# EasyEDA Pro project LED_DRIVER.eprj

# Schematic Schematic1
Create Date: 2022-12-01; Page Name: P1; Project Name: LED_DRIVER; Schematic Name: Schematic1; Update Date: 2022-12-01; Company: 东南大学3SE战队; Drawed: 彭延璞
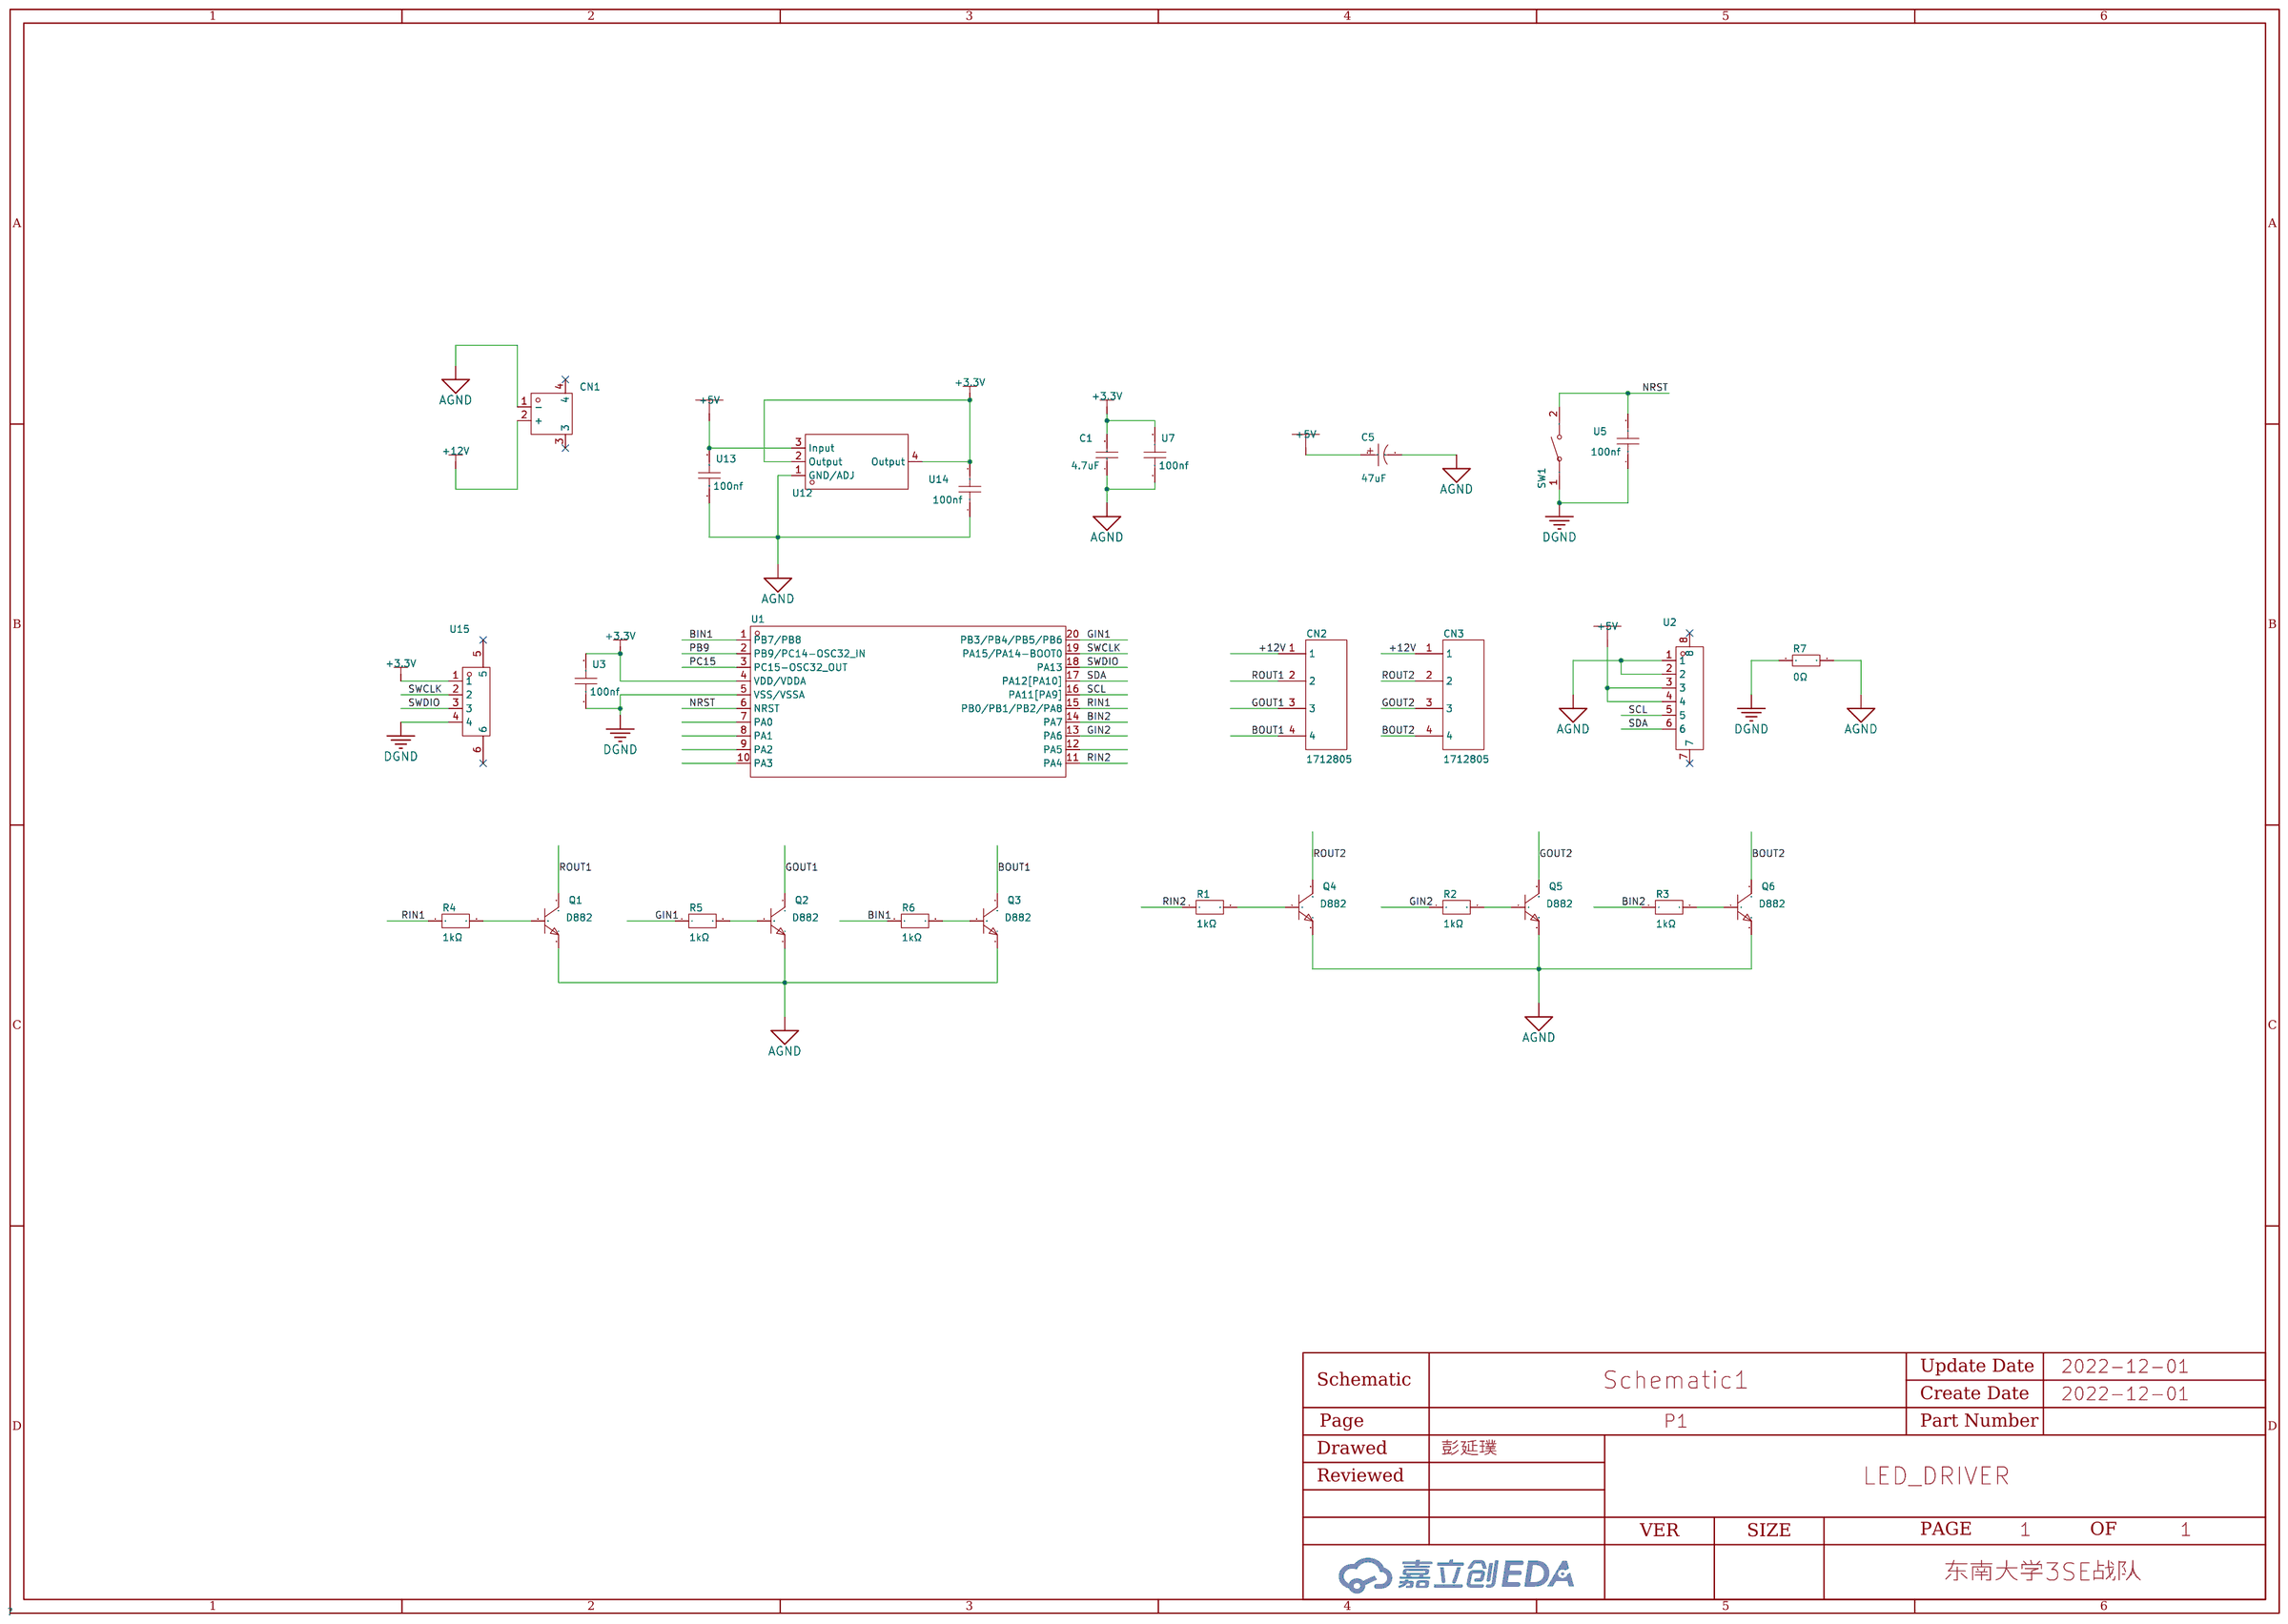
[diagram p0: schematic sheet]

## Parts
C1  4.7uF  [C0603]
C5  47uF  [CAP-SMD_BD6.3-L6.6-W6.6-FD]
CN1  XT60PW-M  [CONN-TH_XT60PW-M]
CN2  1712805  [CONN-TH_4P-P5.08_1712805]
CN3  1712805  [CONN-TH_4P-P5.08_1712805]
Q1  D882  [TO-252-3_L6.5-W5.5-P4.6-LS9.5-BL]
Q2  D882  [TO-252-3_L6.5-W5.5-P4.6-LS9.5-BL]
Q3  D882  [TO-252-3_L6.5-W5.5-P4.6-LS9.5-BL]
Q4  D882  [TO-252-3_L6.5-W5.5-P4.6-LS9.5-BL]
Q5  D882  [TO-252-3_L6.5-W5.5-P4.6-LS9.5-BL]
Q6  D882  [TO-252-3_L6.5-W5.5-P4.6-LS9.5-BL]
R1  1kΩ  [R0603]
R2  1kΩ  [R0603]
R3  1kΩ  [R0603]
R4  1kΩ  [R0603]
R5  1kΩ  [R0603]
R6  1kΩ  [R0603]
R7  0Ω  [R1206]
SW1  -  [KEY-SMD_L6.2-W3.6-LS8.0]
U1  STM32G030F6P6  [TSSOP-20_L6.5-W4.4-P0.65-LS6.4-BL]
U2  -  [CONN-SMD_6P-P1.25_GH1.25-6PWBPZ]
U3  100nf  [C0603]
U5  100nf  [C0603]
U7  100nf  [C0603]
U12  -  [SOT-223-4_L6.5-W3.5-P2.30-LS7.0-BR]
U13  100nf  [C0603]
U14  100nf  [C0603]
U15  -  [CONN-SMD_GH1.25-4PWBPZ]

## Library data of the parts
C1 = 0603F475M160NT: 容值:4.7uF;精度:±20%;额定电压:16V;温度系数:Y5V;; LCSC Part Name: 4.7uF ±20% 16V; Supplier Part: C94039; Manufacturer: FH(风华); Supplier Footprint: 0603; JLCPCB Part Class: Extended Part; Datasheet: https://atta.szlcsc.com/upload/public/pdf/source/20171212/C94039_15130640218931178027.pdf; Supplier: LCSC; Tolerance: ±20%; Voltage Rated: 16V; Temperature Coefficient: Y5V
C5 = RVT1V470M0605_C3344: 容值:47uF;精度:±20%;额定电压:35V;电容体直径:6.3mm;电容体长度:5.4mm;纹波电流:-;等效串联电阻:-;工作寿命:2000hrs@105℃;工作温度:-55℃~+105℃;; LCSC Part Name: 47uF ±20% 35V; Supplier Part: C3344; Manufacturer: HONOR(荣誉); Manufacturer Part: RVT1V470M0605; Supplier Footprint: SMD,6.3x5.4mm; JLCPCB Part Class: Extended Part; Datasheet: https://atta.szlcsc.com/upload/public/pdf/source/20210521/C113284_25C86AE95FB541053FE695F13EA8E7D0.pdf; Supplier: LCSC; Tolerance: ±20%; Rated Voltage: 35V; φD: 6.3mm; L: 5.4mm; Lifetime @ Temp: 2000hrs@105℃; Operating Temperature: -55℃~+105℃
CN1 = XT60PW-M: 模型锂电连接器; LCSC Part Name: XT60PW 公头 板插卧式; Supplier Part: C98732; Manufacturer: AMASS(艾迈斯); Supplier Footprint: Through Hole; JLCPCB Part Class: Extended Part; Datasheet: https://atta.szlcsc.com/upload/public/pdf/source/20180125/C98732_15168617837851301983.pdf; Supplier: LCSC
CN2 CN3 = 1712805: 间距:5.08mm;排数:1;每排PIN数:4;安装方式:直针;额定电流:24A;额定电压:400V;线规 - AWG:-;线规 - mm?:-;工作温度范围:-;颜色:绿色;; LCSC Part Name: 5.08mm 排数:1 每排P数:4 直针 可拼接; Supplier Part: C90087; Manufacturer: Phoenix Contact(菲尼克斯); Supplier Footprint: P=5.08mm; JLCPCB Part Class: 扩展库; Datasheet: https://atta.szlcsc.com/upload/public/pdf/source/20161209/1481271748212.pdf; Supplier: LCSC; Pitch: 5.08mm; Number of Rows: 1; Number of PINs Per Row: 4; Mounting Style: 直针; Current Rating (Max): 24A; Voltage Rating (Max): 400V; Color: 绿色
Q1-Q6 = D882_C2897489: 晶体管类型:NPN;集射极击穿电压(Vceo):30V;集电极电流(Ic):3A;功率(Pd):1.25W;集电极截止电流(Icbo):1uA;集电极-发射极饱和电压(VCE(sat)@Ic,Ib):500mV@2A,200mA;直流电流增益(hFE@Ic,Vce):160@1A,2V;特征频率(fT):80MHz;工作温度:+150@(Tj);; LCSC Part Name: NPN 30V 3A TO-252; Supplier Part: C2897489; Manufacturer: YONGYUTAI(永裕泰); Supplier Footprint: TO-252; JLCPCB Part Class: Extended Part; Datasheet: https://atta.szlcsc.com/upload/public/pdf/source/20210918/5EF979D5544858A19C6B9B735176911E.pdf; Supplier: LCSC; Transistor Type: NPN; Collector-Emitter Breakdown Voltage (Vceo): 30V; Collector Current (Ic): 3A; Power Dissipation (Pd): 1.25W; Collector Cut-Off Current (Icbo): 1uA; Collector-Emitter Saturation Voltage (VCE(sat)@Ic,Ib): 500mV@2A,200mA; DC Current Gain (hFE@Ic,Vce): 160@1A,2V; Transition Frequency (fT): 80MHz; Operating Temperature: +150@(Tj)
R1-R6 = SCR0603J1K: 阻值:1kΩ;精度:±5%;; LCSC Part Name: 1kΩ ±5%; Supplier Part: C3017736; Manufacturer: VO(翔胜); Supplier Footprint: 0603; JLCPCB Part Class: Extended Part; Datasheet: https://atta.szlcsc.com/upload/public/pdf/source/20220513/247AF9639BA21CF93567DC289CCC6A22.pdf; Supplier: LCSC; Tolerance: ±5%
R7 = RK73Z2BTTD: 阻值:0Ω;精度:-;功率:-;工作温度范围:-55~+155;; LCSC Part Name: 0Ω 0; Supplier Part: C131706; Manufacturer: KOA; Supplier Footprint: 1206; JLCPCB Part Class: Extended Part; Datasheet: https://atta.szlcsc.com/upload/public/pdf/source/20170918/C131706_1505727048923976489.pdf; Supplier: LCSC; Operating Temperature Range: -55~+155
SW1 = K2-1107ST-A4DW-06: 触点电流:50mA;额定电压(DC):12V;绝缘电阻:100MΩ;电路结构:单刀单掷;安装方式:立贴;按钮形状:矩形按钮;带灯:-;作用力:250gf@±30gf;机械寿命:100000;工作温度:-25℃~+85℃;开关长度:6.1mm;开关宽度:3.6mm;开关高度:2.5mm;; LCSC Part Name: 轻触开关 3.6*6.1*2.5; Supplier Part: C118141; Manufacturer: 韩国韩荣; Supplier Footprint: SMD; JLCPCB Part Class: Extended Part; Datasheet: https://atta.szlcsc.com/upload/public/pdf/source/20210810/381712CEF248770C072B585C3485C888.pdf; Supplier: LCSC; Contact Current: 50mA; Voltage Rating (DC): 12V; Insulation Resistance: 100MΩ; Circuit: 单刀单掷; Mounting Style: 立贴; Actuator Style: 矩形按钮; Operating Force: 250gf@±30gf; Mechanical Life: 100000; Operating Temperature: -25℃~+85℃; Switch Length: 6.1mm; Switch Width: 3.6mm; Switch Height: 2.5mm
U1 = STM32G030F6P6: CPU位数:-;ROM类型:-;CPU内核:-;主频（MAX):-;工作电压:-;; Supplier Part: C724040; Manufacturer: ST(意法半导体); Supplier Footprint: TSSOP-20; JLCPCB Part Class: Extended Part; Datasheet: https://atta.szlcsc.com/upload/public/pdf/source/20200511/C529329_A1CB615556C746C4EA827FCAD1461480.pdf; Supplier: LCSC
U2 = GH1.25-6PWBPZ: LCSC Part Name: GH1.25-6P卧贴编带; Supplier Part: C2829255; Manufacturer: BOOMELE(博穆精密); JLCPCB Part Class: Extended Part; Datasheet: https://atta.szlcsc.com/upload/public/pdf/source/20211125/08A09A4909F58AF780B71FE423A00F7E.pdf; Supplier: LCSC
U3 U5 U7 U13 U14 = VJ0603Y104KXAAC: Supplier Part: C511432; Manufacturer: VISHAY(威世); Supplier Footprint: 0603; JLCPCB Part Class: Extended Part; Supplier: LCSC
U12 = AMS1117-3.3_C369933: 输出类型:固定;输出极性:正;输出通道数:1;最大输入电压:18V;输出电压:3.3V;压差:1.3V@800mA;静态电流(地电流):8mA;输出电流:1A;电源纹波抑制比(PRSS):-;噪声:-;特性:-;工作温度:-;; LCSC Part Name: Vin=18V Vout=3.3V 1A; Supplier Part: C369933; Manufacturer: KEXIN(科信); Manufacturer Part: AMS1117-3.3; Supplier Footprint: SOT-223; JLCPCB Part Class: Extended Part; Datasheet: https://atta.szlcsc.com/upload/public/pdf/source/20190724/C369933_94137CB0CFA8D6ABD8E5DA714A2C2C4B.pdf; Supplier: LCSC; Output Type: 固定; Output Polarity: 正; Number of Outputs: 1; Maximum Input Voltage: 18V; Output Voltage: 3.3V; Dropout Voltage: 1.3V@800mA; Quiescent Current (Ground Current): 8mA; Output Current: 1A
U15 = GH1.25-4PWBPZ: LCSC Part Name: GH1.25-4P卧贴编带; Supplier Part: C2829253; Manufacturer: BOOMELE(博穆精密); JLCPCB Part Class: Extended Part; Datasheet: https://atta.szlcsc.com/upload/public/pdf/source/20211125/08A09A4909F58AF780B71FE423A00F7E.pdf; Supplier: LCSC

## Nets
+3.3V: C1.2 U1.4(VDD/VDDA) U3.2 U7.2 U12.2(Output) U12.4(Output) U14.2 U15.1
+5V: C5.1 U2.3 U2.4 U12.3(Input) U13.2
+12V: CN1.2(+) CN2.1 CN3.1
AGND: C1.1 C5.2 CN1.1(-) Q1.3(E) Q2.3(E) Q3.3(E) Q4.3(E) Q5.3(E) Q6.3(E) R7.2 U2.1 U2.2 U7.1 U12.1(GND/ADJ) U13.1 U14.1
DGND: R7.1 SW1.1 U1.5(VSS/VSSA) U3.1 U5.1 U15.4
BIN1: R6.1 U1.1(PB7/PB8)
BIN2: R3.1 U1.14(PA7)
BOUT1: CN2.4 Q3.2(C)
BOUT2: CN3.4 Q6.2(C)
GIN1: R5.1 U1.20(PB3/PB4/PB5/PB6)
GIN2: R2.1 U1.13(PA6)
GOUT1: CN2.3 Q2.2(C)
GOUT2: CN3.3 Q5.2(C)
NRST: SW1.2 U1.6(NRST) U5.2
PB9: U1.2(PB9/PC14-OSC32_IN)
PC15: U1.3(PC15-OSC32_OUT)
RIN1: R4.1 U1.15(PB0/PB1/PB2/PA8)
RIN2: R1.1 U1.11(PA4)
ROUT1: CN2.2 Q1.2(C)
ROUT2: CN3.2 Q4.2(C)
SCL: U1.16(PA11[PA9]) U2.5
SDA: U1.17(PA12[PA10]) U2.6
SWCLK: U1.19(PA15/PA14-BOOT0) U15.2
SWDIO: U1.18(PA13) U15.3
$1N1836: Q1.1(B) R4.2
$1N1837: Q2.1(B) R5.2
$1N1838: Q3.1(B) R6.2
$1N1856: Q4.1(B) R1.2
$1N1857: Q5.1(B) R2.2
$1N1858: Q6.1(B) R3.2

Not connected (* = marked no-connect by the designer): CN1 3* 4*; U1 7(PA0) 8(PA1) 9(PA2) 10(PA3) 12(PA5); U2 7* 8*; U15 5* 6*

# Board PCB1
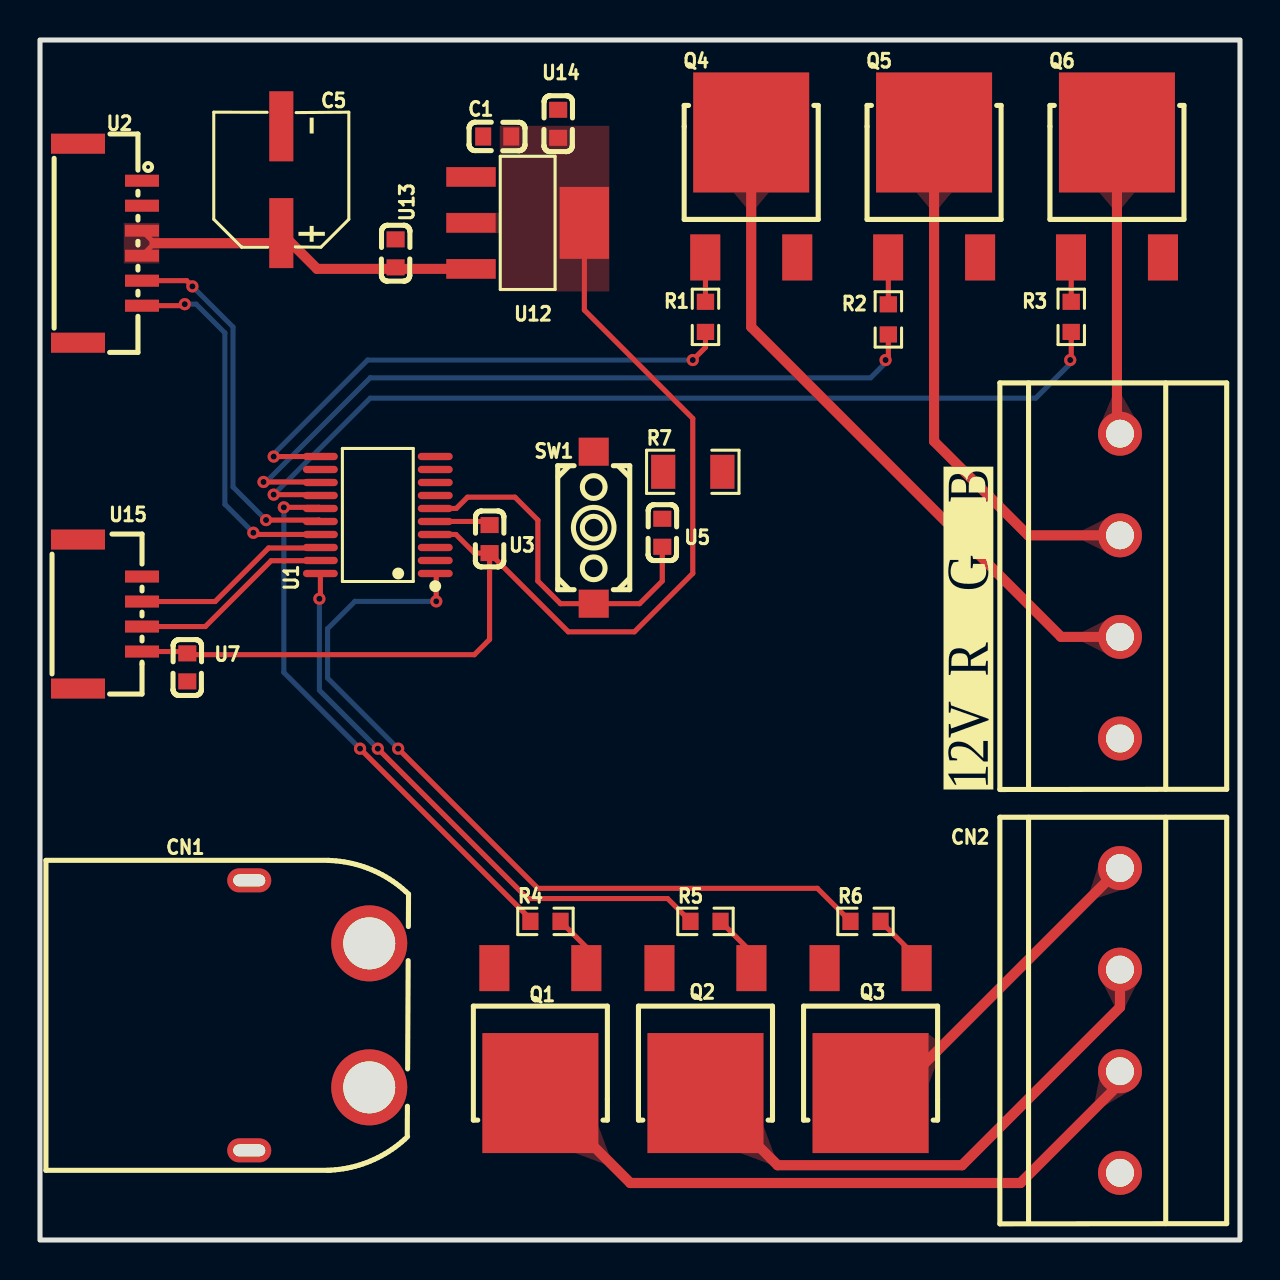
[diagram p1: board, top side]
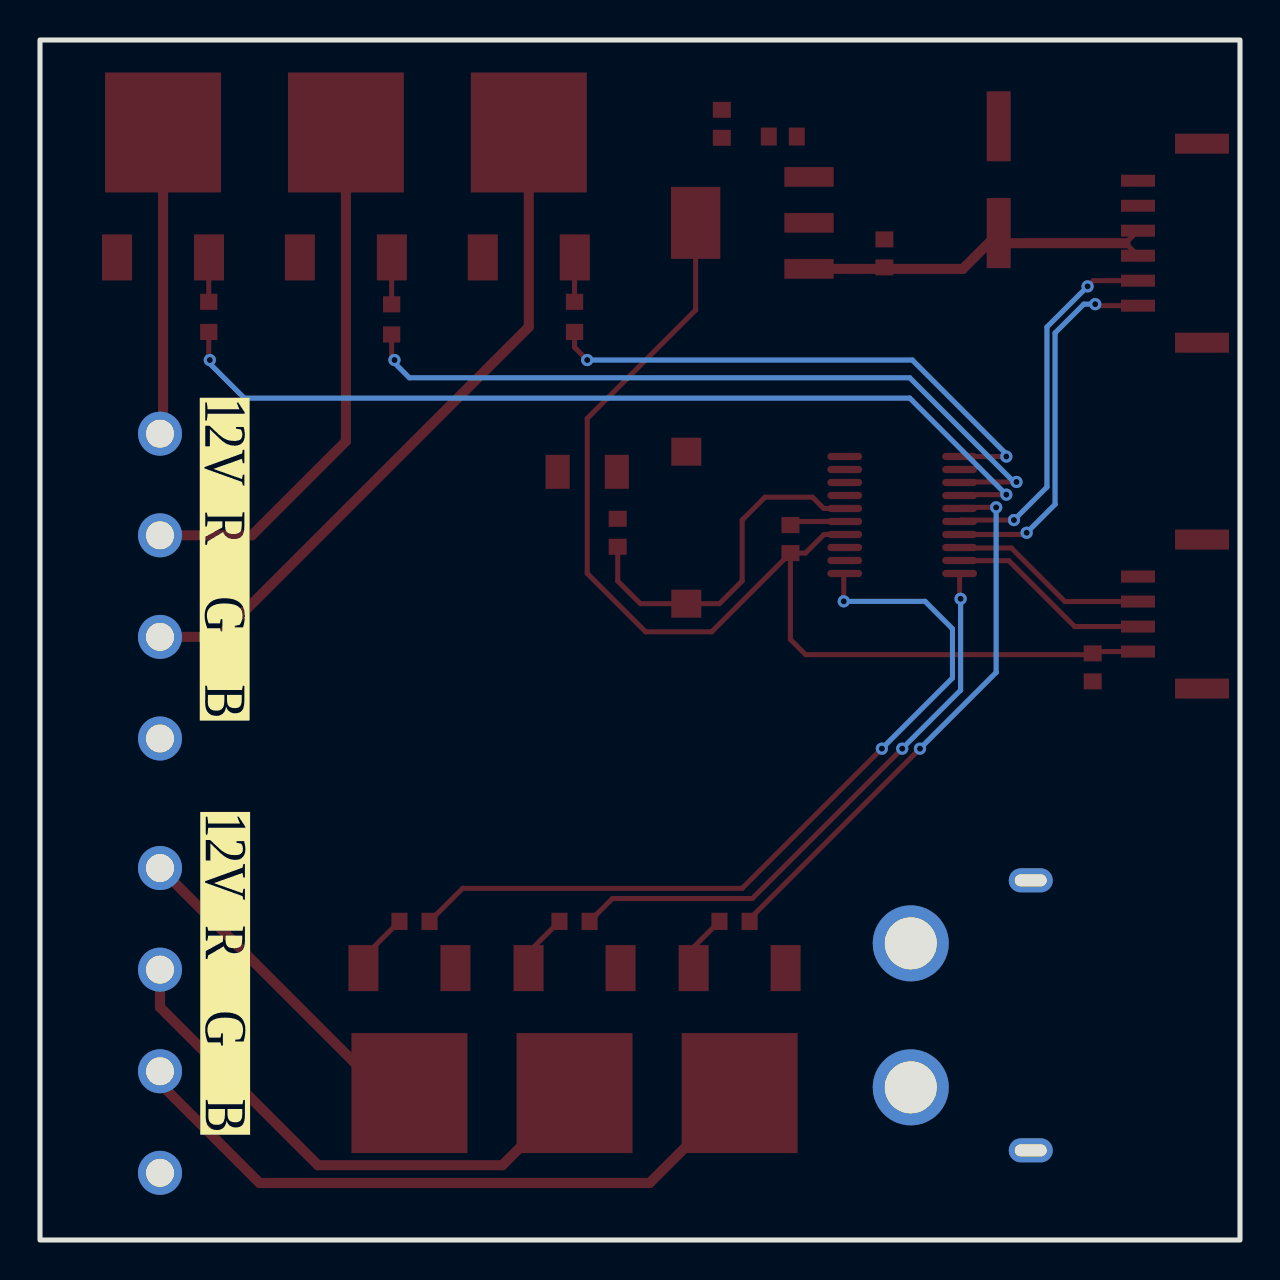
[diagram p2: board, bottom side, seen from below]

Outline 60 x 60 mm; copper layers: Top Layer, Bottom Layer. Coordinates in mm from the lower left corner of the outline.
Outline path: rectangle 0,60 60,0
Stack: Top Layer 0.035mm / Dielectric1 1.51mm FR4 er 4.5 / Bottom Layer 0.035mm

## Design rules (mm)
spacing safeClearance (default): track to track 0.152, other pairs 0.152 to 0.3
track width trackWidth (default): min 0.127, default 0.254, max 2.54
track width POWER: min 0.127, default 0.508, max 2.54
differential pair differentialPair (default): width min 0.127, default 0.254, max 2.54; gap min 0.152, default 0.152
via viaSize (default): diameter min 0.5, default 0.61, max 10; hole min 0.3, default 0.305, max 6
net AGND uses copperRegion1
net +5V uses POWER, copperRegion1
net +12V uses POWER, copperRegion1
net ROUT1 uses POWER
net GOUT1 uses POWER
net BOUT1 uses POWER
net ROUT2 uses POWER
net GOUT2 uses POWER
net BOUT2 uses POWER
pour e723 uses copperRegion1

## Placement (name value [footprint] x y rotation side)
C1  4.7uF  [C0603]  22.86 55.17 0 top
C5  47uF  [CAP-SMD_BD6.3-L6.6-W6.6-FD]  12.06 53.02 90 top
CN1  XT60PW-M  [CONN-TH_XT60PW-M]  13.46 11.23 0 top
CN2  1712805  [CONN-TH_4P-P5.08_1712805]  54 10.98 90 top
CN3  1712805  [CONN-TH_4P-P5.08_1712805]  54 32.69 90 top
Q1  D882  [TO-252-3_L6.5-W5.5-P4.6-LS9.5-BL]  25.02 10.47 180 top
Q2  D882  [TO-252-3_L6.5-W5.5-P4.6-LS9.5-BL]  33.27 10.47 180 top
Q3  D882  [TO-252-3_L6.5-W5.5-P4.6-LS9.5-BL]  41.53 10.47 180 top
Q4  D882  [TO-252-3_L6.5-W5.5-P4.6-LS9.5-BL]  35.56 52.25 0 top
Q5  D882  [TO-252-3_L6.5-W5.5-P4.6-LS9.5-BL]  44.7 52.25 0 top
Q6  D882  [TO-252-3_L6.5-W5.5-P4.6-LS9.5-BL]  53.85 52.25 0 top
R1  1kΩ  [R0603]  33.27 46.16 90 top
R2  1kΩ  [R0603]  42.42 46.03 90 top
R3  1kΩ  [R0603]  51.56 46.16 90 top
R4  1kΩ  [R0603]  25.27 15.93 0 top
R5  1kΩ  [R0603]  33.27 15.93 0 top
R6  1kΩ  [R0603]  41.28 15.93 0 top
R7  0Ω  [R1206]  32.64 38.41 0 top
SW1  -  [KEY-SMD_L6.2-W3.6-LS8.0]  27.69 35.62 270 top
U1  STM32G030F6P6  [TSSOP-20_L6.5-W4.4-P0.65-LS6.4-BL]  16.89 36.25 90 top
U2  -  [CONN-SMD_6P-P1.25_GH1.25-6PWBPZ]  3.5 49.84 270 top
U3  100nf  [C0603]  22.48 35.05 270 top
U5  100nf  [C0603]  31.12 35.36 270 top
U7  100nf  [C0603]  7.37 28.63 90 top
U12  -  [SOT-223-4_L6.5-W3.5-P2.30-LS7.0-BR]  24.38 50.86 180 top
U13  100nf  [C0603]  17.78 49.33 270 top
U14  100nf  [C0603]  25.91 55.81 270 top
U15  -  [CONN-SMD_GH1.25-4PWBPZ]  3.5 31.3 90 top

## Footprints (pads in the part's own frame, mm; a bottom-side part is the same pattern mirrored in y, then rotated)
C0603
  rect 0.8x0.9 smd: 1(-0.7,0) 2(0.7,0)
CAP-SMD_BD6.3-L6.6-W6.6-FD
  rect 3.5x1.2 smd: 1(-2.67,0) 2(2.67,0)
CONN-SMD_6P-P1.25_GH1.25-6PWBPZ
  rect 0.6x1.7 smd: 1(-3.124,1.6) 2(-1.875,1.6) 3(-0.625,1.6) 4(0.625,1.6) 5(1.875,1.6) 6(3.124,1.6)
  rect 1.001x2.7 smd: 7(-4.976,-1.6) 8(4.976,-1.6)
CONN-SMD_GH1.25-4PWBPZ
  rect 0.6x1.7 smd: 1(-1.875,-1.601) 2(-0.625,-1.601) 3(0.625,-1.601) 4(1.875,-1.601)
  rect 1x2.7 smd: 5(-3.725,1.601) 6(3.725,1.601)
CONN-TH_4P-P5.08_1712805
  round 2.2 hole 1.399: 1(-7.62,0) 2(-2.54,0) 3(2.54,0) 4(7.62,0)
CONN-TH_XT60PW-M
  round 3.8 hole 2.6: 1(3,-3.6) 2(3,3.6)
  oval 2.2x1.2 hole 1.6x0.6: 3(-3,6.75) 4(-3,-6.75)
KEY-SMD_L6.2-W3.6-LS8.0
  rect 1.399x1.501 smd: 1(-3.8,0) 2(3.8,0)
R0603
  rect 0.806x0.864 smd: 1(-0.753,0) 2(0.753,0)
R1206
  rect 1.208x1.701 smd: 1(-1.479,0) 2(1.479,0)
SOT-223-4_L6.5-W3.5-P2.30-LS7.0-BR
  rect 2.469x0.981 smd: 1(2.834,-2.299) 2(2.834,0) 3(2.834,2.301)
  rect 2.469x3.599 smd: 4(-2.834,0)
TO-252-3_L6.5-W5.5-P4.6-LS9.5-BL
  rect 1.501x2.301 smd: 1(-2.299,-3.124) 3(2.301,-3.124)
  rect 5.799x6 smd: 2(0,3.124)
TSSOP-20_L6.5-W4.4-P0.65-LS6.4-BL
  oval 0.364x1.742 smd: 1(-2.925,-2.871) 2(-2.275,-2.871) 3(-1.625,-2.871) 4(-0.975,-2.871) 5(-0.325,-2.871) 6(0.325,-2.871) 7(0.975,-2.871) 8(1.625,-2.871) 9(2.275,-2.871) 10(2.925,-2.871) 11(2.925,2.871) 12(2.275,2.871) 13(1.625,2.871) 14(0.975,2.871) 15(0.325,2.871) 16(-0.325,2.871) 17(-0.975,2.871) 18(-1.625,2.871) 19(-2.275,2.871) 20(-2.925,2.871)

## Nets
As in the schematic.

Pads without a net: CN1 3 4; U2 7 8; U15 5 6

## Via types
v1: diameter 0.61, hole 0.305, Top Layer to Bottom Layer, 16 vias

## Routing (per net, layer and track width the routed paths; a pad name or vN(x,y) marks a point on that pad's centre or on a via; arc(x,y) is an arc through that point)
+3.3V: length 58
  Top Layer w0.254: U1.4 20.8,35.28 21.73,34.35 U3.2 ; U3.2 26.42,30.41 29.72,30.41 32.64,33.33 32.64,41.08 27.22,46.5 U12.4 ; U3.2 22.48,30.03 21.72,29.27 7.43,29.27 U7.2 7.27,29.42 U15.1
+5V: length 18.5
  Top Layer w0.254: U2.3 5.72,49.84 U2.4
  Top Layer w0.5: C5.1 13.85,48.56 21.55,48.56
  Top Layer w0.508: C5.1 11.56,49.84 5.72,49.84
DGND: length 2.8
  Top Layer w0.254: U1.5 22.3,35.93 U3.1
BIN1: length 41.1
  Top Layer w0.254: U1.1 19.81,33.28 v1(19.81,31.93) ; R6.1 38.87,17.58 24.89,17.58 v1(17.91,24.57)
  Bottom Layer w0.254: v1(17.91,24.57) 14.38,28.1 14.38,30.56 15.75,31.93 v1(19.81,31.93)
BIN2: length 46.5
  Top Layer w0.254: R3.1 51.56,44.05 v1(51.51,44) ; v1(11.68,37.27) 13.98,37.27 U1.14
  Bottom Layer w0.254: v1(51.51,44) 51.51,43.82 49.78,42.09 16.51,42.09 v1(11.68,37.27)
BOUT1: length 17.1
  Top Layer w0.508: Q3.2 42.75,7.35 CN2.4
BOUT2: length 15.1
  Top Layer w0.504: CN3.4 53.85,40.47 Q6.2
GIN1: length 29.2
  Top Layer w0.254: R5.1 31.38,17.07 24.38,17.07 v1(16.89,24.57) ; U1.20 14.02,32.11 v1(13.97,32.06)
  Bottom Layer w0.254: v1(13.97,32.06) 13.97,27.49 v1(16.89,24.57)
GIN2: length 37.6
  Top Layer w0.254: v1(11.18,37.9) 13.99,37.9 U1.13 ; R2.1 42.42,44.14 v1(42.28,44)
  Bottom Layer w0.254: 42.16,43.74 41.53,43.11 16.51,43.11 11.3,37.9 v1(11.18,37.9)
GOUT1: length 27.4
  Top Layer w0.508: CN2.3 54,11.64 46.1,3.74 36.88,3.74 Q2.2
GOUT2: length 26.7
  Top Layer w0.504: CN3.3 49.4,35.23 44.7,39.93 Q5.2
NRST: length 17.8
  Top Layer w0.254: U1.6 20.81,36.58 21.37,37.14 23.75,37.14 24.89,36 24.89,32.95 26.03,31.82 SW1.2 29.98,31.82 31.12,32.95 U5.2
RIN1: length 27.7
  Top Layer w0.254: v1(16,24.57) 24.52,16.05 R4.1 ; v1(12.19,36.63) 13.96,36.63 U1.15
  Bottom Layer w0.254: v1(16,24.57) 12.19,28.38 v1(12.19,36.63)
RIN2: length 27
  Top Layer w0.254: v1(11.68,39.17) 14.02,39.17 U1.11 ; v1(32.64,44) 33.27,44.63 R1.1
  Bottom Layer w0.254: v1(32.64,44) 16.38,44 11.68,39.3 v1(11.68,39.17)
ROUT1: length 33.5
  Top Layer w0.508: Q1.2 29.51,2.85 49.02,2.85 54,7.83 CN2.2
ROUT2: length 34.6
  Top Layer w0.504: 54,30.16 51.05,30.16 35.56,45.65 Q4.2
SCL: length 18.6
  Top Layer w0.254: v1(11.3,36) 13.95,36 U1.16 ; U2.5 7.34,47.97 v1(7.62,47.68)
  Bottom Layer w0.254: v1(11.3,36) 9.65,37.65 9.65,45.65 v1(7.62,47.68)
SDA: length 18.7
  Top Layer w0.254: v1(7.24,46.79) 7.16,46.72 U2.6 ; U1.17 10.75,35.28 v1(10.67,35.36)
  Bottom Layer w0.254: v1(10.67,35.36) 9.25,36.78 9.25,45.35 7.81,46.79 v1(7.24,46.79)
SWCLK: length 10.3
  Top Layer w0.254: U1.19 14.01,33.97 11.56,33.97 8.26,30.67 U15.2
SWDIO: length 10
  Top Layer w0.254: U15.3 8.75,31.92 11.43,34.6 13.99,34.6 U1.18
$1N1836: length 2.9
  Top Layer w0.254: R4.2 27.32,14.64 Q1.1
$1N1837: length 3
  Top Layer w0.254: Q2.1 35.57,14.39 R5.2
$1N1838: length 3.1
  Top Layer w0.254: R6.2 43.83,14.13 Q3.1
$1N1856: length 2.2
  Top Layer w0.254: Q4.1 33.27,49.12 R1.2
$1N1857: length 2.4
  Top Layer w0.254: Q5.1 42.42,49.12 R2.2
$1N1858: length 2.2
  Top Layer w0.254: R3.2 51.56,49.12 Q6.1

## Copper pours and planes (outline as drawn; the poured copper is in the pictures)
+3.3V on Top Layer: 20.32,55.71 28.47,55.71 28.47,47.43 20.32,47.43
+5V on Top Layer: 4.19,50.86 5.97,50.86 5.97,48.82 4.19,48.82
+12V on Bottom Layer: 13.34,13.01 14.22,12.25 45.97,12.12 48.01,10.34 47.99,2.17 49.23,0.94 58.17,0.94 59.33,2.1 59.33,27.59 58.29,28.63 49.66,28.63 48.01,26.98 48.01,18.98 45.97,17.2 14.1,17.2 13.34,16.44
AGND on Top Layer: 1,59 59,59 59,1 1,1
DGND on Top Layer: 32.13,40.7 0.38,40.7 0.38,28.89 32.13,28.89

Small or netless copper shapes (teardrops, artwork), in the pictures only: 12 on Top Layer

## Text on the board
Bottom Silkscreen Layer: 12V  R    G    B
Top Silkscreen Layer: 12V  R    G    B
